# Altium schematic sheet Wolf-Lite_UM.SchDoc
size A3; Address1: Address1; Address2: Address2; Address3: Address3; Address4: Address4; DocumentNumber: АБВГ.123456.001 Э3; SheetNumber: 1; Scale: 1:1; DocumentType: Схема электрическая принципиальная; FirstReferrence: АБВГ.123456.001
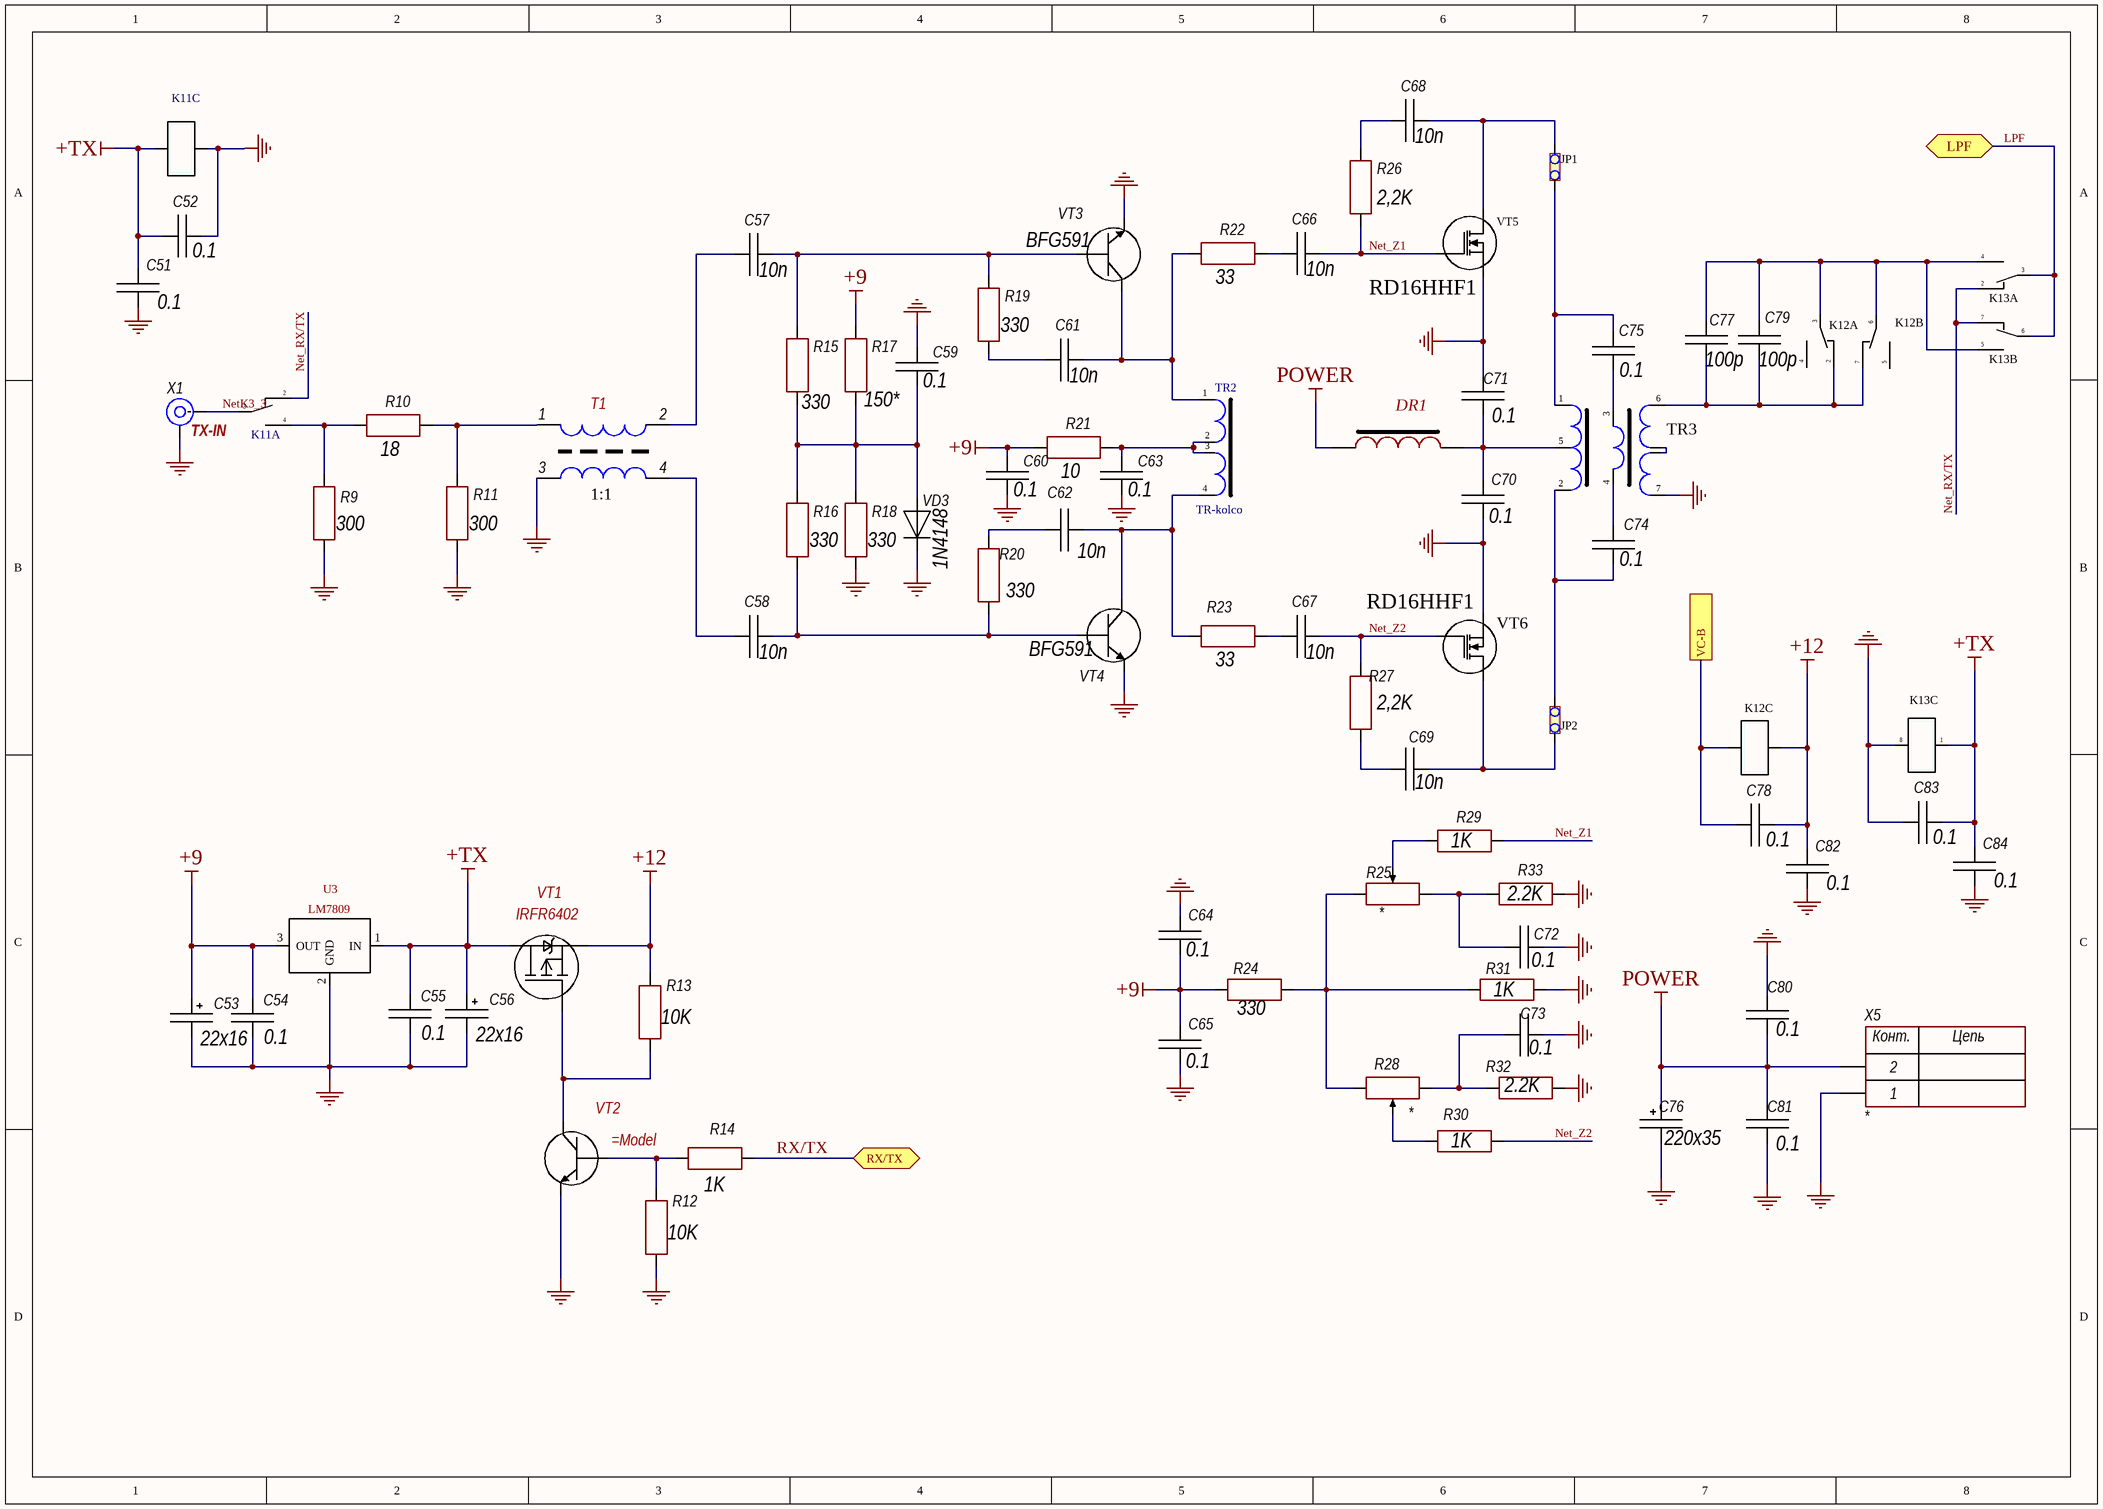
[diagram p0: Wolf-Lite_UM.SchDoc]

## Parts
C51  0.1  [CH0805C]
C52  0.1  [CH0805C]
C53  22x16  [TANTAL_B]
C54  0.1  [CH0805C]
C55  0.1  [CH0805C]
C56  22x16  [TANTAL_B]
C57  10n  [CH0805C]
C58  10n  [CH0805C]
C59  0.1  [CH0805C]
C60  0.1  [CH0805C]
C61  10n  [CH0805C]
C62  10n  [CH0805C]
C63  0.1  [CH0805C]
C64  0.1  [CH0805C]
C65  0.1  [CH0805C]
C66  10n  [CH0805C]
C67  10n  [CH0805C]
C68  10n  [CH1206C]
C69  10n  [CH1206C]
C70  0.1  [CH0805C]
C71  0.1  [CH0805C]
C72  0.1  [CH0805C]
C73  0.1  [CH0805C]
C74  0.1  [CH1206C]
C75  0.1  [CH1206C]
C76  220x35  [D8C3.2H12]
C77  100p  [CH1206C]
C78  0.1  [CH0805C]
C79  100p  [CH1206C]
C80  0.1  [CH0805C]
C81  0.1  [CH0805C]
C82  0.1  [CH0805C]
C83  0.1  [CH0805C]
C84  0.1  [CH0805C]
DR1  10uH  [DR2]  (value not drawn)
JP1  JP1  [CON: PLS-2]  (value not drawn)
JP2  JP2  [CON: PLS-2]  (value not drawn)
K11  IM06  [IMG06]  (value not drawn)  (parts A,C of 3)
K12  IM06  [IMG06]  (value not drawn)  (parts A,B,C of 3)
K13  IM06  [IMG06]  (value not drawn)  (parts A,B,C of 3)
R9  300  [CH0805R]
R10  18  [CH0805R]
R11  300  [CH0805R]
R12  10K  [CH0805R]
R13  10K  [CH0805R]
R14  1K  [CH0805R]
R15  330  [CH0805R]
R16  330  [CH0805R]
R17  150*  [CH0805R]
R18  330  [CH0805R]
R19  330  [CH0805R]
R20  330  [CH0805R]
R21  10  [CH0805R]
R22  33  [CH0805R]
R23  33  [CH0805R]
R24  330  [CH0805R]
R25  *  [RES: 3296W]
R26  2,2K  [CH1206R]
R27  2,2K  [CH1206R]
R28  *  [RES: 3296W]
R29  1K  [CH0805R]
R30  1K  [CH0805R]
R31  1K  [CH0805R]
R32  2.2K  [CH0805R]
R33  2.2K  [CH0805R]
T1  BN-43-302  [FT-37-43]  (value not drawn)
TR2  TR-kolco  [TR-Kolco]
TR3  TR-UM  [TR-UM]  (value not drawn)
U3  LM7809  [DPAK]
VD3  1N4148  [SOD123]
VT1  IRFR6402  [SOT23_132]
VT2  (no value)  [SOT23_123]
VT3  BFG591  [BFG]
VT4  BFG591  [BFG]
VT5  RD16HHF1  [rd16]
VT6  RD16HHF1  [rd16]
X1  TX-IN  [CON: SMA]
X5  *  [CON: 300-02P-5.0]

## Ports
LPF (bidir), RX/TX (bidir), VC-B

## Nets
+9: C53.1 C54.2 C60.2 C64.1 C65.1 R17.2 R21.1 R24.1 U3.3(OUT)
+12: C78.2 C82.2 K12.1 R13.2 VT1.2(I)
+TX: C51.2 C52.1 C55.2 C56.1 C83.2 C84.2 K11.1 K13.1 U3.1(IN) VT1.3(Сток(Drain))
GND: C51.1 C52.2 C53.2 C54.1 C55.1 C56.2 C59.2 C60.1 C63.1 C64.2 C65.2 C70.2 C71.2 C72.1 C73.1 C76.2 C80.1 C81.1 C82.1 C83.1 C84.1 K11.8 K13.8 R9.1 R11.1 R12.1 R18.1 R31.2 R32.2 R33.2 T1.3 TR3.7 U3.2(GND) VD3.2 VT2.3(E) VT3.3(E) VT4.3(E) VT5.2(S) VT6.2(S) X1.2(IN) X5.1
POWER: C76.1 C80.2 C81.2 DR1.2 X5.2
LPF: K13.3 K13.6 ; port LPF
Net_RX/TX: K11.2 K13.2 K13.7
Net_Z1: C66.2 R26.1 R29.2 VT5.1(G)
Net_Z2: C67.2 R27.1 R30.2 VT6.1(G)
NetK3_3: K11.3 X1.1(IN)
RX/TX: R14.1 ; port RX/TX
VC-B: C78.1 K12.8 ; port VC-B
NetC57_1: C57.1 T1.2
NetC57_2: C57.2 R15.2 R19.2 VT3.2(B)
NetC58_1: C58.1 T1.4
NetC58_2: C58.2 R16.1 R20.2 VT4.2(B)
NetC59_1: C59.1 R15.1 R16.2 R17.1 R18.2 VD3.1
NetC61_1: C61.1 R19.1
NetC61_2: C61.2 R22.1 TR2.1 VT3.1(C)
NetC62_1: C62.1 R20.1
NetC62_2: C62.2 R23.1 TR2.4 VT4.1(C)
NetC63_2: C63.2 R21.2 TR2.2 TR2.3
NetC66_1: C66.1 R22.2
NetC67_1: C67.1 R23.2
NetC68_1: C68.1 R26.2
NetC68_2: C68.2 JP1.1 VT5.3(D)
NetC69_1: C69.1 R27.2
NetC69_2: C69.2 JP2.1 VT6.3(D)
NetC70_1: C70.1 C71.1 DR1.1 TR3.5
NetC72_2: C72.2 R25.3 R33.1
NetC73_2: C73.2 R28.3 R32.1
NetC74_1: C74.1 JP2.2 TR3.2
NetC74_2: C74.2 TR3.4
NetC75_1: C75.1 JP1.2 TR3.1
NetC75_2: C75.2 TR3.3
NetC77_1: C77.1 C79.1 K12.3 K12.6 K13.4 K13.5
NetC77_2: C77.2 C79.2 K12.2 K12.7 TR3.6
NetK11_4: K11.4 R9.2 R10.1
NetR10_2: R10.2 R11.2 T1.1
NetR12_2: R12.2 R14.2 VT2.1(B)
NetR13_1: R13.1 VT1.1(Затвор(Gate)) VT2.2(C)
NetR24_2: R24.2 R25.1 R28.1 R31.1
NetR25_2: R25.2 R29.1
NetR28_2: R28.2 R30.1
NetTR3_8: TR3.8 TR3.9

Not connected (* = marked no-connect by the designer): K12 4 5

## Notes on the sheet
- (near T1) 1:1
- Title
- Size:
- Date:
- A3
- Number:
- Time:
- Revision:
- Sheet
- of
- File:
- (in symbol 2-Connector) Конт.; Цепь

## Library data of the parts
C51 C52 C54 C55 C57-C75 C77-C84 = Capacitor: Manufacturer: *; Model: *; HelpURL: *; ComponentKind: *; Value: *
C53 C56 C76 = AlumCap: Manufacturer: *; Model: *; HelpURL: *; ComponentKind: *; Value: *
DR1 = Inductor-1
JP1 = JP2
K11-K13 = IM06-1
R9-R24 R26 R27 R29-R33 = Resistor: Manufacturer: *; Model: *; HelpURL: *; ComponentKind: *; Value: *
R25 R28 = ADJ resistor: Manufacturer: *; Model: *; HelpURL: *; ComponentKind: *; Value: *
U3 = Kren_5
VD3 = Diod: ComponentKind: *; Manufacturer: *; Model: *; HelpURL: *
VT1 = P-KANAL
VT2-VT4 = N-P-N
VT5 VT6 = N
X1 = SMA: RF; System: Connector; Model: *; Manufacturer: *; HelpURL: *; ComponentKind: *
X5 = 2-Connector: Model: *; Manufacturer: *; HelpURL: *; ComponentKind: *